# Altium schematic sheet SCH-MB202-00.SchDoc
size A3
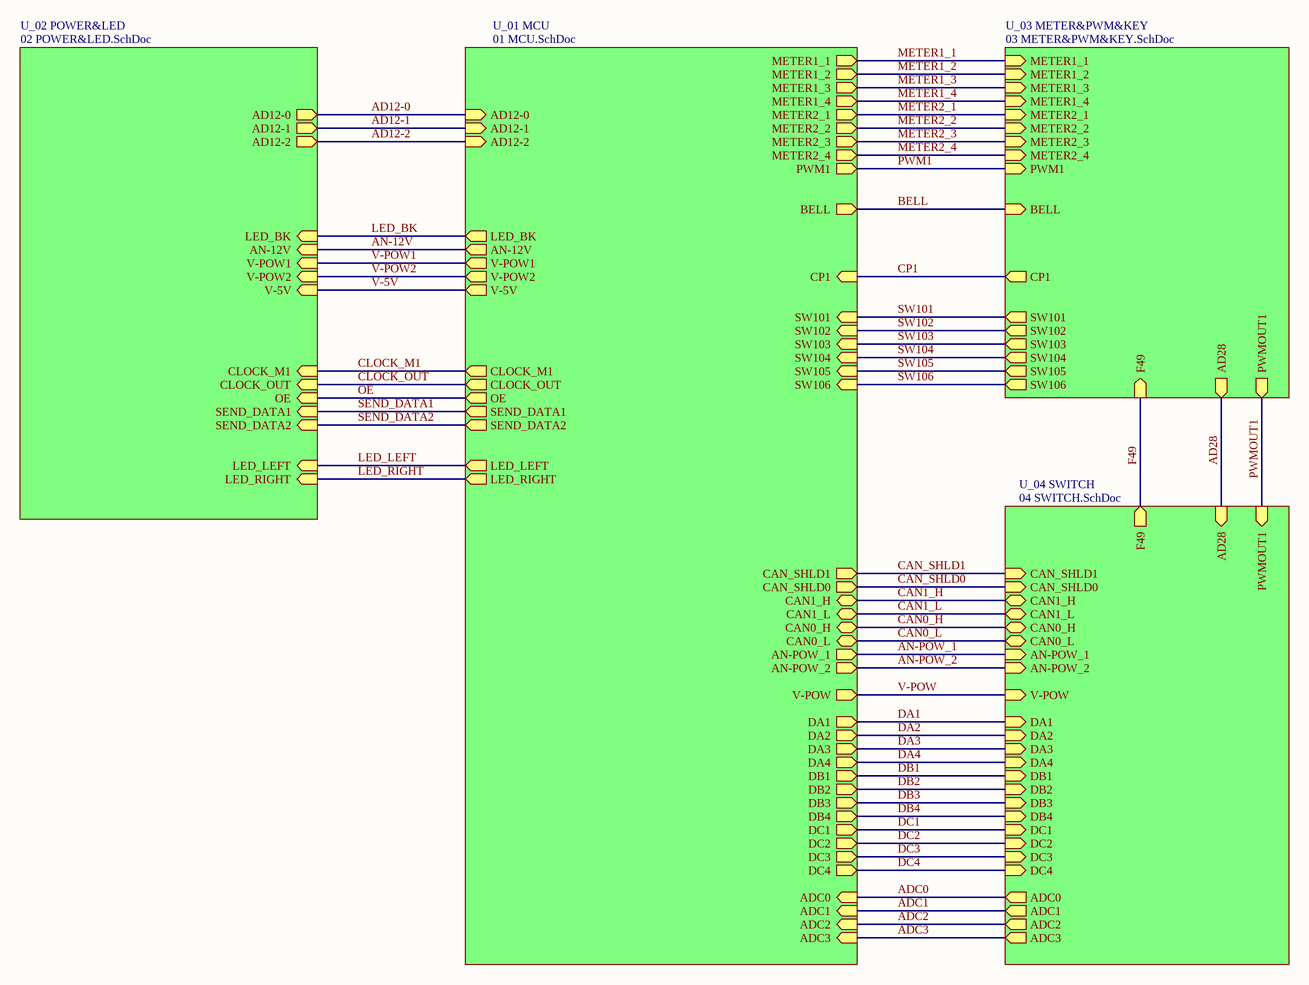
[diagram p0: SCH-MB202-00.SchDoc]

## Sub-sheets
U_01 MCU = 01 MCU.SchDoc: METER1_1 (out), METER1_2 (out), METER1_3 (out), METER1_4 (out), METER2_1 (out), METER2_2 (out), METER2_3 (out), METER2_4 (out), SW101 (in), SW102 (in), SW103 (in), SW104 (in), CP1 (in), DA1 (out), DA2 (out), DA3 (out), DA4 (out), DB1 (out), DB2 (out), DB3 (out), DB4 (out), DC1 (out), DC2 (out), DC3 (out), DC4 (out), ADC0 (in), ADC1 (in), ADC2 (in), ADC3 (in), LED_BK (out), PWM1 (out), V-POW (out), AN-POW_1 (out), V-5V (out), CAN_SHLD1 (out), CAN1_H (bidir), CAN1_L (bidir), CAN_SHLD0 (out), CAN0_H (bidir), CAN0_L (bidir), V-POW1 (out), V-POW2 (out), AD12-1 (in), AD12-2 (in), AN-12V (out), AN-POW_2 (out), AD12-0 (in), CLOCK_M1 (out), CLOCK_OUT (out), SEND_DATA1 (out), OE (out), SEND_DATA2 (out), BELL (out), LED_RIGHT (out), LED_LEFT (out), SW105 (in), SW106 (in)
U_02 POWER&LED = 02 POWER&LED.SchDoc: LED_BK (in), AD12-0 (out), AN-12V (in), AD12-1 (out), V-POW1 (in), AD12-2 (out), V-POW2 (in), V-5V (in), CLOCK_M1 (in), CLOCK_OUT (in), SEND_DATA1 (in), OE (in), SEND_DATA2 (in), LED_LEFT (in), LED_RIGHT (in)
U_03 METER&PWM&KEY = 03 METER&PWM&KEY.SchDoc: METER1_1 (in), METER1_2 (in), METER1_3 (in), METER1_4 (in), METER2_1 (in), METER2_2 (in), METER2_3 (in), METER2_4 (in), SW101 (out), SW102 (out), SW103 (out), SW104 (out), PWM1 (in), PWMOUT1 (out), AD28 (out), CP1 (out), F49 (in), BELL (in), SW105 (out), SW106 (out)
U_04 SWITCH = 04 SWITCH.SchDoc: F49 (out), PWMOUT1 (in), CAN0_H (bidir), CAN_SHLD0 (in), CAN0_L (bidir), CAN1_L (bidir), CAN1_H (bidir), CAN_SHLD1 (in), AN-POW_1 (in), AN-POW_2 (in), V-POW (in), ADC0 (out), ADC1 (out), ADC2 (out), ADC3 (out), DA1 (in), DA2 (in), DA3 (in), DA4 (in), DB1 (in), DB2 (in), DB3 (in), DB4 (in), DC1 (in), DC2 (in), DC3 (in), DC4 (in), AD28 (in)

## Nets
AD12-0: sheet U_01 MCU/AD12-0, sheet U_02 POWER&LED/AD12-0
AD12-1: sheet U_01 MCU/AD12-1, sheet U_02 POWER&LED/AD12-1
AD12-2: sheet U_01 MCU/AD12-2, sheet U_02 POWER&LED/AD12-2
AD28: sheet U_03 METER&PWM&KEY/AD28, sheet U_04 SWITCH/AD28
ADC0: sheet U_01 MCU/ADC0, sheet U_04 SWITCH/ADC0
ADC1: sheet U_01 MCU/ADC1, sheet U_04 SWITCH/ADC1
ADC2: sheet U_01 MCU/ADC2, sheet U_04 SWITCH/ADC2
ADC3: sheet U_01 MCU/ADC3, sheet U_04 SWITCH/ADC3
AN-12V: sheet U_01 MCU/AN-12V, sheet U_02 POWER&LED/AN-12V
AN-POW_1: sheet U_01 MCU/AN-POW_1, sheet U_04 SWITCH/AN-POW_1
AN-POW_2: sheet U_01 MCU/AN-POW_2, sheet U_04 SWITCH/AN-POW_2
BELL: sheet U_01 MCU/BELL, sheet U_03 METER&PWM&KEY/BELL
CAN0_H: sheet U_01 MCU/CAN0_H, sheet U_04 SWITCH/CAN0_H
CAN0_L: sheet U_01 MCU/CAN0_L, sheet U_04 SWITCH/CAN0_L
CAN1_H: sheet U_01 MCU/CAN1_H, sheet U_04 SWITCH/CAN1_H
CAN1_L: sheet U_01 MCU/CAN1_L, sheet U_04 SWITCH/CAN1_L
CAN_SHLD0: sheet U_01 MCU/CAN_SHLD0, sheet U_04 SWITCH/CAN_SHLD0
CAN_SHLD1: sheet U_01 MCU/CAN_SHLD1, sheet U_04 SWITCH/CAN_SHLD1
CLOCK_M1: sheet U_01 MCU/CLOCK_M1, sheet U_02 POWER&LED/CLOCK_M1
CLOCK_OUT: sheet U_01 MCU/CLOCK_OUT, sheet U_02 POWER&LED/CLOCK_OUT
CP1: sheet U_01 MCU/CP1, sheet U_03 METER&PWM&KEY/CP1
DA1: sheet U_01 MCU/DA1, sheet U_04 SWITCH/DA1
DA2: sheet U_01 MCU/DA2, sheet U_04 SWITCH/DA2
DA3: sheet U_01 MCU/DA3, sheet U_04 SWITCH/DA3
DA4: sheet U_01 MCU/DA4, sheet U_04 SWITCH/DA4
DB1: sheet U_01 MCU/DB1, sheet U_04 SWITCH/DB1
DB2: sheet U_01 MCU/DB2, sheet U_04 SWITCH/DB2
DB3: sheet U_01 MCU/DB3, sheet U_04 SWITCH/DB3
DB4: sheet U_01 MCU/DB4, sheet U_04 SWITCH/DB4
DC1: sheet U_01 MCU/DC1, sheet U_04 SWITCH/DC1
DC2: sheet U_01 MCU/DC2, sheet U_04 SWITCH/DC2
DC3: sheet U_01 MCU/DC3, sheet U_04 SWITCH/DC3
DC4: sheet U_01 MCU/DC4, sheet U_04 SWITCH/DC4
F49: sheet U_03 METER&PWM&KEY/F49, sheet U_04 SWITCH/F49
LED_BK: sheet U_01 MCU/LED_BK, sheet U_02 POWER&LED/LED_BK
LED_LEFT: sheet U_01 MCU/LED_LEFT, sheet U_02 POWER&LED/LED_LEFT
LED_RIGHT: sheet U_01 MCU/LED_RIGHT, sheet U_02 POWER&LED/LED_RIGHT
METER1_1: sheet U_01 MCU/METER1_1, sheet U_03 METER&PWM&KEY/METER1_1
METER1_2: sheet U_01 MCU/METER1_2, sheet U_03 METER&PWM&KEY/METER1_2
METER1_3: sheet U_01 MCU/METER1_3, sheet U_03 METER&PWM&KEY/METER1_3
METER1_4: sheet U_01 MCU/METER1_4, sheet U_03 METER&PWM&KEY/METER1_4
METER2_1: sheet U_01 MCU/METER2_1, sheet U_03 METER&PWM&KEY/METER2_1
METER2_2: sheet U_01 MCU/METER2_2, sheet U_03 METER&PWM&KEY/METER2_2
METER2_3: sheet U_01 MCU/METER2_3, sheet U_03 METER&PWM&KEY/METER2_3
METER2_4: sheet U_01 MCU/METER2_4, sheet U_03 METER&PWM&KEY/METER2_4
OE: sheet U_01 MCU/OE, sheet U_02 POWER&LED/OE
PWM1: sheet U_01 MCU/PWM1, sheet U_03 METER&PWM&KEY/PWM1
PWMOUT1: sheet U_03 METER&PWM&KEY/PWMOUT1, sheet U_04 SWITCH/PWMOUT1
SEND_DATA1: sheet U_01 MCU/SEND_DATA1, sheet U_02 POWER&LED/SEND_DATA1
SEND_DATA2: sheet U_01 MCU/SEND_DATA2, sheet U_02 POWER&LED/SEND_DATA2
SW101: sheet U_01 MCU/SW101, sheet U_03 METER&PWM&KEY/SW101
SW102: sheet U_01 MCU/SW102, sheet U_03 METER&PWM&KEY/SW102
SW103: sheet U_01 MCU/SW103, sheet U_03 METER&PWM&KEY/SW103
SW104: sheet U_01 MCU/SW104, sheet U_03 METER&PWM&KEY/SW104
SW105: sheet U_01 MCU/SW105, sheet U_03 METER&PWM&KEY/SW105
SW106: sheet U_01 MCU/SW106, sheet U_03 METER&PWM&KEY/SW106
V-5V: sheet U_01 MCU/V-5V, sheet U_02 POWER&LED/V-5V
V-POW: sheet U_01 MCU/V-POW, sheet U_04 SWITCH/V-POW
V-POW1: sheet U_01 MCU/V-POW1, sheet U_02 POWER&LED/V-POW1
V-POW2: sheet U_01 MCU/V-POW2, sheet U_02 POWER&LED/V-POW2